# EAGLE schematic Drone-Battery Connection (EAGLE 8.4.1)
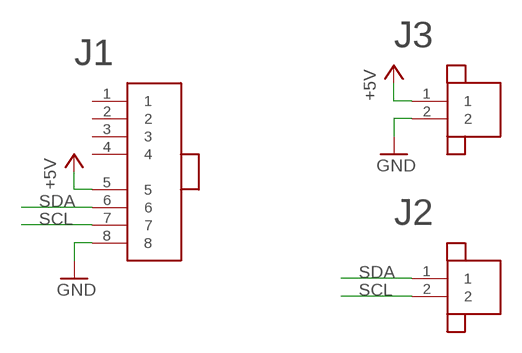
[diagram p0: schematic, sheet 1]

## Parts
J1  SPRING_BTB_8POS_MALE  [SPRING_BTB_8POS_MALE]
J2  JST_SH_2POS  [JST_SH_2POS]
J3  JST_SH_2POS  [JST_SH_2POS]

## Nets
+5V: J1.5 J3.1
GND: J1.8 J3.2
SCL: J1.7 J2.2
SDA: J1.6 J2.1
Unconnected: J1.1 J1.2 J1.3 J1.4

## Library data of the parts
J1 = thanics_robotics:SPRING_BTB_8POS_MALE
J2 J3 = thanics_robotics:JST_SH_2POS